# EAGLE design plinkykeeb_choc_12Feb2022 (EAGLE 9.6.2)
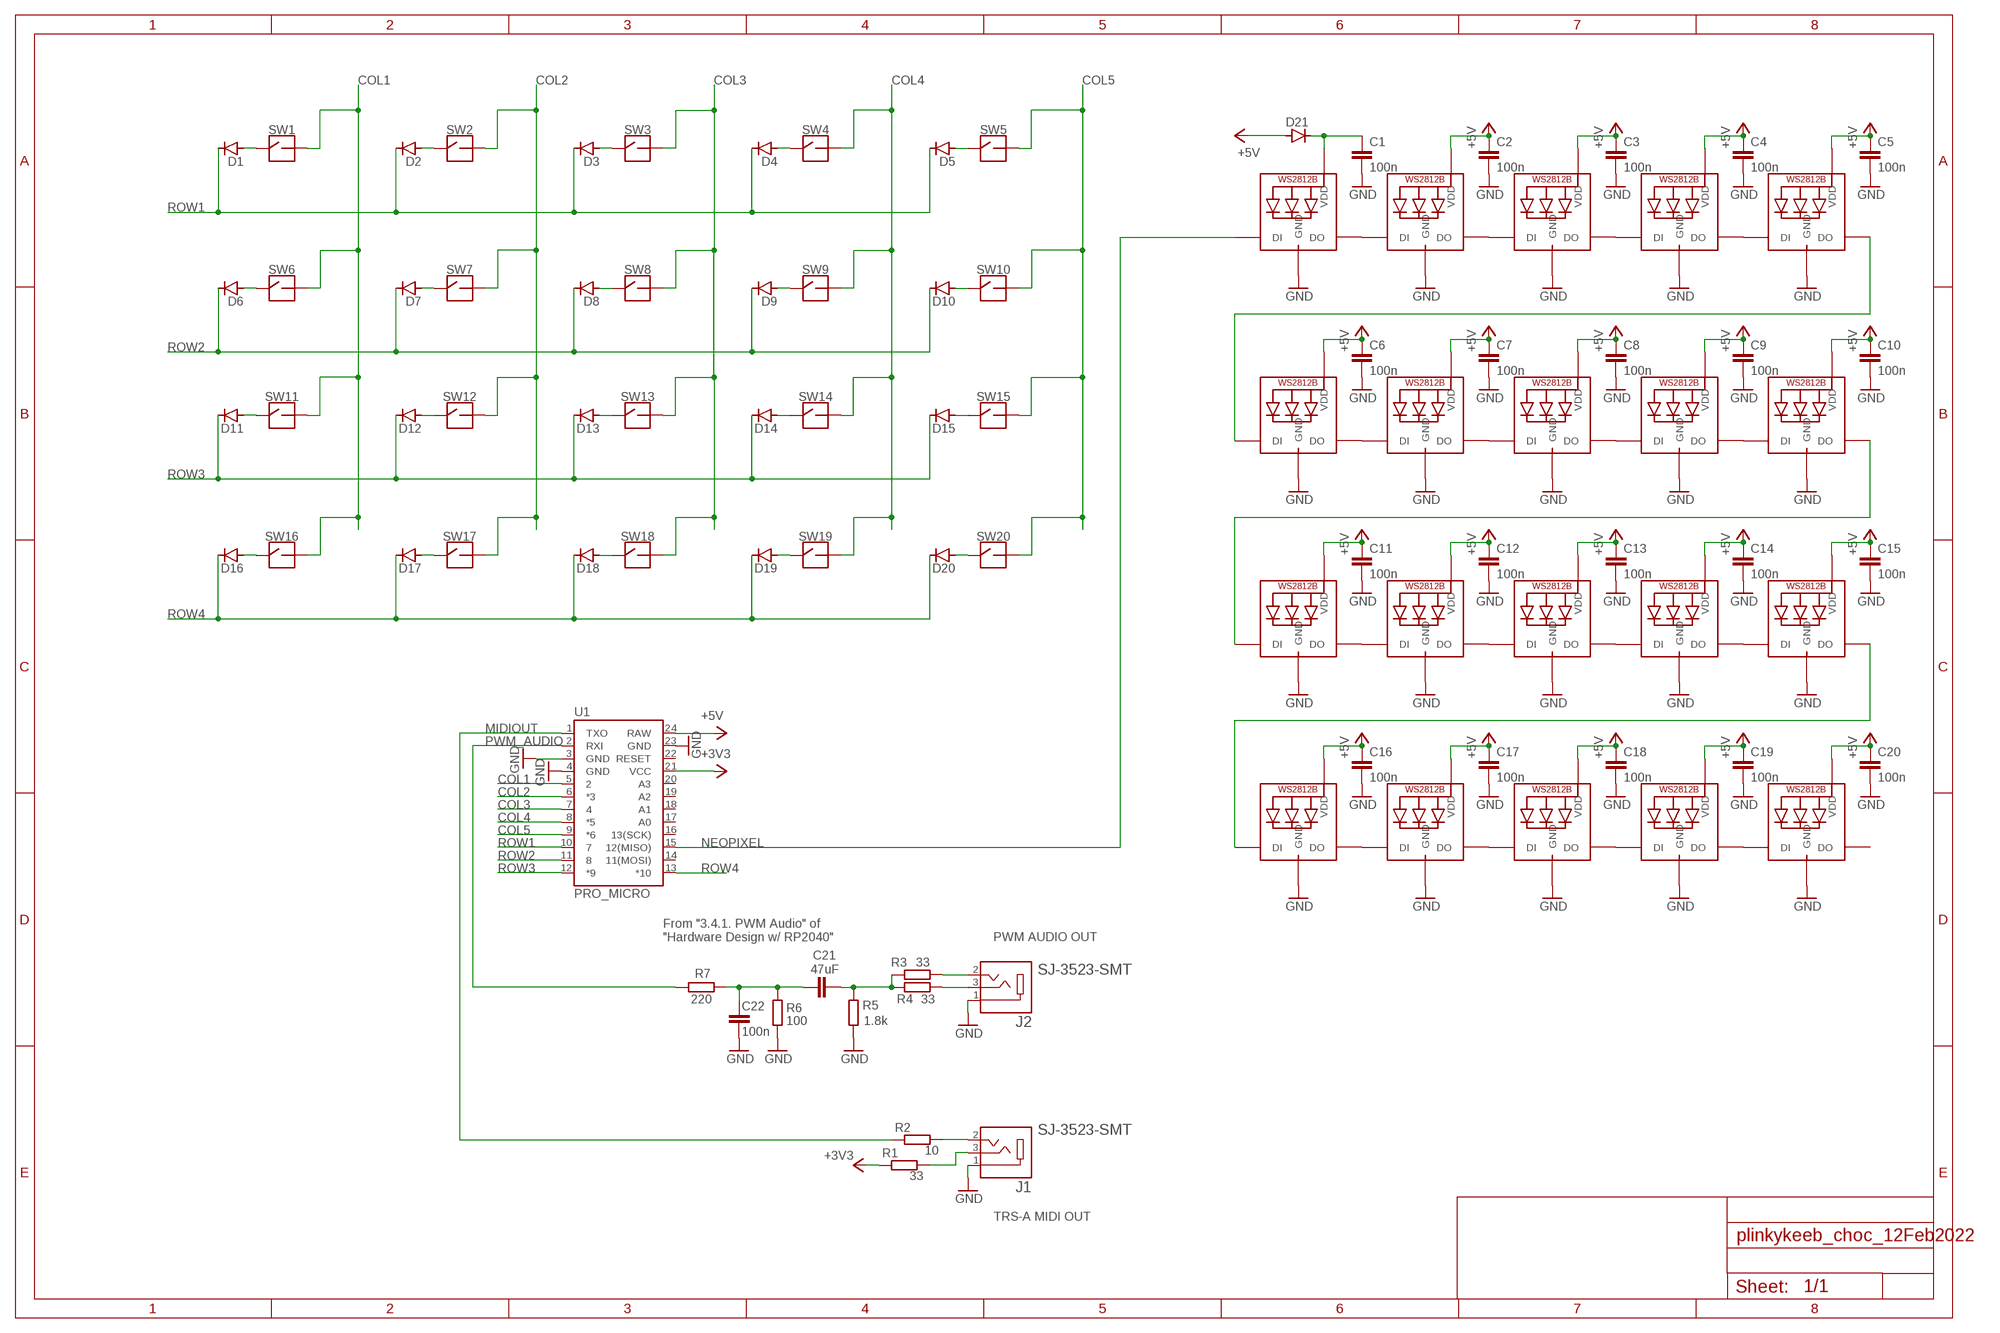
[diagram p0: schematic, sheet 1]

## Parts
C1  100n  C-EUC0805  [C0805]
C2  100n  C-EUC0805  [C0805]
C3  100n  C-EUC0805  [C0805]
C4  100n  C-EUC0805  [C0805]
C5  100n  C-EUC0805  [C0805]
C6  100n  C-EUC0805  [C0805]
C7  100n  C-EUC0805  [C0805]
C8  100n  C-EUC0805  [C0805]
C9  100n  C-EUC0805  [C0805]
C10  100n  C-EUC0805  [C0805]
C11  100n  C-EUC0805  [C0805]
C12  100n  C-EUC0805  [C0805]
C13  100n  C-EUC0805  [C0805]
C14  100n  C-EUC0805  [C0805]
C15  100n  C-EUC0805  [C0805]
C16  100n  C-EUC0805  [C0805]
C17  100n  C-EUC0805  [C0805]
C18  100n  C-EUC0805  [C0805]
C19  100n  C-EUC0805  [C0805]
C20  100n  C-EUC0805  [C0805]
C21  47uF  C-EUC0805  [C0805]
C22  100n  C-EUC0805  [C0805]
D1  D-SOD123  [SOD123]
D2  D-SOD123  [SOD123]
D3  D-SOD123  [SOD123]
D4  D-SOD123  [SOD123]
D5  D-SOD123  [SOD123]
D6  D-SOD123  [SOD123]
D7  D-SOD123  [SOD123]
D8  D-SOD123  [SOD123]
D9  D-SOD123  [SOD123]
D10  D-SOD123  [SOD123]
D11  D-SOD123  [SOD123]
D12  D-SOD123  [SOD123]
D13  D-SOD123  [SOD123]
D14  D-SOD123  [SOD123]
D15  D-SOD123  [SOD123]
D16  D-SOD123  [SOD123]
D17  D-SOD123  [SOD123]
D18  D-SOD123  [SOD123]
D19  D-SOD123  [SOD123]
D20  D-SOD123  [SOD123]
D21  D-SOD123  [SOD123]
J1  SJ-3523-SMT  [CUI_SJ-3523-SMT]
J2  SJ-3523-SMT  [CUI_SJ-3523-SMT]
LED1  MICROBUILDER_WS2812B_SK6812E  [MICROBUILDER_NEO3535_REVERSE]
LED2  MICROBUILDER_WS2812B_SK6812E  [MICROBUILDER_NEO3535_REVERSE]
LED3  MICROBUILDER_WS2812B_SK6812E  [MICROBUILDER_NEO3535_REVERSE]
LED4  MICROBUILDER_WS2812B_SK6812E  [MICROBUILDER_NEO3535_REVERSE]
LED5  MICROBUILDER_WS2812B_SK6812E  [MICROBUILDER_NEO3535_REVERSE]
LED6  MICROBUILDER_WS2812B_SK6812E  [MICROBUILDER_NEO3535_REVERSE]
LED7  MICROBUILDER_WS2812B_SK6812E  [MICROBUILDER_NEO3535_REVERSE]
LED8  MICROBUILDER_WS2812B_SK6812E  [MICROBUILDER_NEO3535_REVERSE]
LED9  MICROBUILDER_WS2812B_SK6812E  [MICROBUILDER_NEO3535_REVERSE]
LED10  MICROBUILDER_WS2812B_SK6812E  [MICROBUILDER_NEO3535_REVERSE]
LED11  MICROBUILDER_WS2812B_SK6812E  [MICROBUILDER_NEO3535_REVERSE]
LED12  MICROBUILDER_WS2812B_SK6812E  [MICROBUILDER_NEO3535_REVERSE]
LED13  MICROBUILDER_WS2812B_SK6812E  [MICROBUILDER_NEO3535_REVERSE]
LED14  MICROBUILDER_WS2812B_SK6812E  [MICROBUILDER_NEO3535_REVERSE]
LED15  MICROBUILDER_WS2812B_SK6812E  [MICROBUILDER_NEO3535_REVERSE]
LED16  MICROBUILDER_WS2812B_SK6812E  [MICROBUILDER_NEO3535_REVERSE]
LED17  MICROBUILDER_WS2812B_SK6812E  [MICROBUILDER_NEO3535_REVERSE]
LED18  MICROBUILDER_WS2812B_SK6812E  [MICROBUILDER_NEO3535_REVERSE]
LED19  MICROBUILDER_WS2812B_SK6812E  [MICROBUILDER_NEO3535_REVERSE]
LED20  MICROBUILDER_WS2812B_SK6812E  [MICROBUILDER_NEO3535_REVERSE]
R1  33  R-EU_R0805  [R0805]
R2  10  R-EU_R0805  [R0805]
R3  33  R-EU_R0805  [R0805]
R4  33  R-EU_R0805  [R0805]
R5  1.8k  R-EU_R0805  [R0805]
R6  100  R-EU_R0805  [R0805]
R7  220  R-EU_R0805  [R0805]
SW1  KBD_SWITCHKALIH_CHOC_SOCKET  [KALIH_SOCKET_CHOC]
SW2  KBD_SWITCHKALIH_CHOC_SOCKET  [KALIH_SOCKET_CHOC]
SW3  KBD_SWITCHKALIH_CHOC_SOCKET  [KALIH_SOCKET_CHOC]
SW4  KBD_SWITCHKALIH_CHOC_SOCKET  [KALIH_SOCKET_CHOC]
SW5  KBD_SWITCHKALIH_CHOC_SOCKET  [KALIH_SOCKET_CHOC]
SW6  KBD_SWITCHKALIH_CHOC_SOCKET  [KALIH_SOCKET_CHOC]
SW7  KBD_SWITCHKALIH_CHOC_SOCKET  [KALIH_SOCKET_CHOC]
SW8  KBD_SWITCHKALIH_CHOC_SOCKET  [KALIH_SOCKET_CHOC]
SW9  KBD_SWITCHKALIH_CHOC_SOCKET  [KALIH_SOCKET_CHOC]
SW10  KBD_SWITCHKALIH_CHOC_SOCKET  [KALIH_SOCKET_CHOC]
SW11  KBD_SWITCHKALIH_CHOC_SOCKET  [KALIH_SOCKET_CHOC]
SW12  KBD_SWITCHKALIH_CHOC_SOCKET  [KALIH_SOCKET_CHOC]
SW13  KBD_SWITCHKALIH_CHOC_SOCKET  [KALIH_SOCKET_CHOC]
SW14  KBD_SWITCHKALIH_CHOC_SOCKET  [KALIH_SOCKET_CHOC]
SW15  KBD_SWITCHKALIH_CHOC_SOCKET  [KALIH_SOCKET_CHOC]
SW16  KBD_SWITCHKALIH_CHOC_SOCKET  [KALIH_SOCKET_CHOC]
SW17  KBD_SWITCHKALIH_CHOC_SOCKET  [KALIH_SOCKET_CHOC]
SW18  KBD_SWITCHKALIH_CHOC_SOCKET  [KALIH_SOCKET_CHOC]
SW19  KBD_SWITCHKALIH_CHOC_SOCKET  [KALIH_SOCKET_CHOC]
SW20  KBD_SWITCHKALIH_CHOC_SOCKET  [KALIH_SOCKET_CHOC]
U1  PRO_MICRO  SPARKFUN_PRO_MICRO  [SPARKFUN_PRO_MICRO]

## Nets
+3V3: R1.2 U1.21(VCC)
+5V: C2.1 C3.1 C4.1 C5.1 C6.1 C7.1 C8.1 C9.1 C10.1 C11.1 C12.1 C13.1 C14.1 C15.1 C16.1 C17.1 C18.1 C19.1 C20.1 D21.2(A) LED2.1-VDD(VDD) LED3.1-VDD(VDD) LED4.1-VDD(VDD) LED5.1-VDD(VDD) LED6.1-VDD(VDD) LED7.1-VDD(VDD) LED8.1-VDD(VDD) LED9.1-VDD(VDD) LED10.1-VDD(VDD) LED11.1-VDD(VDD) LED12.1-VDD(VDD) LED13.1-VDD(VDD) LED14.1-VDD(VDD) LED15.1-VDD(VDD) LED16.1-VDD(VDD) LED17.1-VDD(VDD) LED18.1-VDD(VDD) LED19.1-VDD(VDD) LED20.1-VDD(VDD) U1.24(RAW)
COL1: SW1.2 SW6.2 SW11.2 SW16.2 U1.5
COL2: SW2.2 SW7.2 SW12.2 SW17.2 U1.6(*3)
COL3: SW3.2 SW8.2 SW13.2 SW18.2 U1.7
COL4: SW4.2 SW9.2 SW14.2 SW19.2 U1.8(*5)
COL5: SW5.2 SW10.2 SW15.2 SW20.2 U1.9(*6)
GND: C1.2 C2.2 C3.2 C4.2 C5.2 C6.2 C7.2 C8.2 C9.2 C10.2 C11.2 C12.2 C13.2 C14.2 C15.2 C16.2 C17.2 C18.2 C19.2 C20.2 C22.2 J1.1 J2.1 LED1.3-GND(GND) LED2.3-GND(GND) LED3.3-GND(GND) LED4.3-GND(GND) LED5.3-GND(GND) LED6.3-GND(GND) LED7.3-GND(GND) LED8.3-GND(GND) LED9.3-GND(GND) LED10.3-GND(GND) LED11.3-GND(GND) LED12.3-GND(GND) LED13.3-GND(GND) LED14.3-GND(GND) LED15.3-GND(GND) LED16.3-GND(GND) LED17.3-GND(GND) LED18.3-GND(GND) LED19.3-GND(GND) LED20.3-GND(GND) R5.2 R6.1 U1.3(GND) U1.4(GND) U1.23(GND)
MIDIOUT: R2.2 U1.1(TXO)
N$1: LED1.2-DOUT(DO) LED2.4-DIN(DI)
N$2: LED2.2-DOUT(DO) LED3.4-DIN(DI)
N$3: LED3.2-DOUT(DO) LED4.4-DIN(DI)
N$4: LED4.2-DOUT(DO) LED5.4-DIN(DI)
N$5: LED5.2-DOUT(DO) LED6.4-DIN(DI)
N$6: D1.2(A) SW1.1
N$7: D2.2(A) SW2.1
N$8: D3.2(A) SW3.1
N$9: D4.2(A) SW4.1
N$10: D5.2(A) SW5.1
N$11: C1.1 D21.1(C) LED1.1-VDD(VDD)
N$12: D6.2(A) SW6.1
N$13: D18.2(A) SW18.1
N$14: D8.2(A) SW8.1
N$15: D9.2(A) SW9.1
N$16: D10.2(A) SW10.1
N$17: D11.2(A) SW11.1
N$18: D12.2(A) SW12.1
N$19: D13.2(A) SW13.1
N$20: D14.2(A) SW14.1
N$21: D15.2(A) SW15.1
N$22: D16.2(A) SW16.1
N$23: D17.2(A) SW17.1
N$24: D19.2(A) SW19.1
N$25: D20.2(A) SW20.1
N$27: LED7.2-DOUT(DO) LED8.4-DIN(DI)
N$28: LED8.2-DOUT(DO) LED9.4-DIN(DI)
N$29: LED9.2-DOUT(DO) LED10.4-DIN(DI)
N$30: LED10.2-DOUT(DO) LED11.4-DIN(DI)
N$31: LED11.2-DOUT(DO) LED12.4-DIN(DI)
N$32: LED6.2-DOUT(DO) LED7.4-DIN(DI)
N$33: D7.2(A) SW7.1
N$34: LED13.2-DOUT(DO) LED14.4-DIN(DI)
N$35: LED14.2-DOUT(DO) LED15.4-DIN(DI)
N$36: LED15.2-DOUT(DO) LED16.4-DIN(DI)
N$37: LED16.2-DOUT(DO) LED17.4-DIN(DI)
N$38: LED17.2-DOUT(DO) LED18.4-DIN(DI)
N$39: LED12.2-DOUT(DO) LED13.4-DIN(DI)
N$40: LED19.2-DOUT(DO) LED20.4-DIN(DI)
N$41: LED18.2-DOUT(DO) LED19.4-DIN(DI)
N$42: J1.2 R2.1
N$43: J1.3 R1.1
N$44: J2.2 R3.1
N$46: J2.3 R4.1
N$47: C21.2 R3.2 R4.2 R5.1
N$48: C21.1 C22.1 R6.2 R7.1
NEOPIXEL: LED1.4-DIN(DI) U1.15(12(MISO))
PWM_AUDIO: R7.2 U1.2(RXI)
ROW1: D1.1(C) D2.1(C) D3.1(C) D4.1(C) D5.1(C) U1.10
ROW2: D6.1(C) D7.1(C) D8.1(C) D9.1(C) D10.1(C) U1.11
ROW3: D11.1(C) D12.1(C) D13.1(C) D14.1(C) D15.1(C) U1.12(*9)
ROW4: D16.1(C) D17.1(C) D18.1(C) D19.1(C) D20.1(C) U1.13(*10)
Unconnected: LED20.2-DOUT(DO) U1.14(11(MOSI)) U1.16(13(SCK)) U1.17(A0) U1.18(A1) U1.19(A2) U1.20(A3) U1.22(RESET)

## Notes on the sheet
- From "3.4.1. PWM Audio" of
  "Hardware Design w/ RP2040"
- PWM AUDIO OUT
- TRS-A MIDI OUT

## Library data of the parts
C1-C22 = rcl:C-EU: CAPACITOR, European symbol; SPICEPREFIX: C
D1-D21 = semicon-smd-ipc:D-: DIODE unfilled
J1 J2 = SJ-3523-SMT:SJ-3523-SMT: Audio Jack Connector 3.5 mm Low Profile Surface Mount Stereo Jack, 3 Pin Right-Angle; CUI_PURCHASE_URL: https://www.cuidevices.com/product/interconnect/connectors/audio-connectors/jacks/sj-352x-smt-series?utm_source=snapeda.com&utm_medium=referral&utm_campaign=snapedaBOM; DESCRIPTION: 3.5 mm, Stereo, Right Angle, Surface Mount (SMT), 3 Conductors, 0~1 Internal Switches, Audio Jack Connector; DIGI-KEY_PART_NUMBER: CP-3523SJCT-ND; MF: CUI Devices; MP: SJ-3523-SMT-TR; PACKAGE: None; PURCHASE-URL: https://pricing.snapeda.com/search/part/SJ-3523-SMT-TR/?ref=eda
LED1-LED20 = Adafruit MacroPad 2040:MICROBUILDER_WS2812B
R1-R7 = rcl:R-EU_: RESISTOR, European symbol; SPICEPREFIX: R
SW1-SW20 = Adafruit MacroPad 2040:KBD_SWITCH
U1 = SparkFun-Boards:SPARKFUN_PRO_MICRO: SparkFun Pro Micro Atmega32U4 compatible footprint. SparkFun Products: 3.3V/8MHz <https://www.sparkfun.com/products/12587> 5V/16MHz <https://www.sparkfun.com/products/12640>

## Board
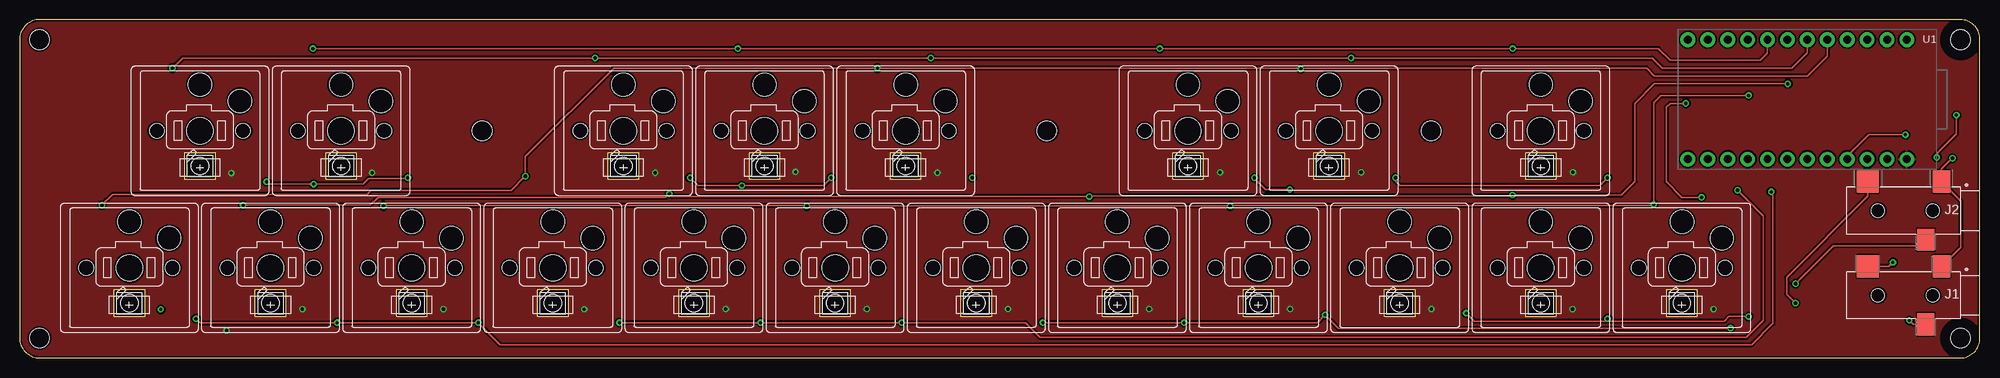
[diagram p1: board, top side]
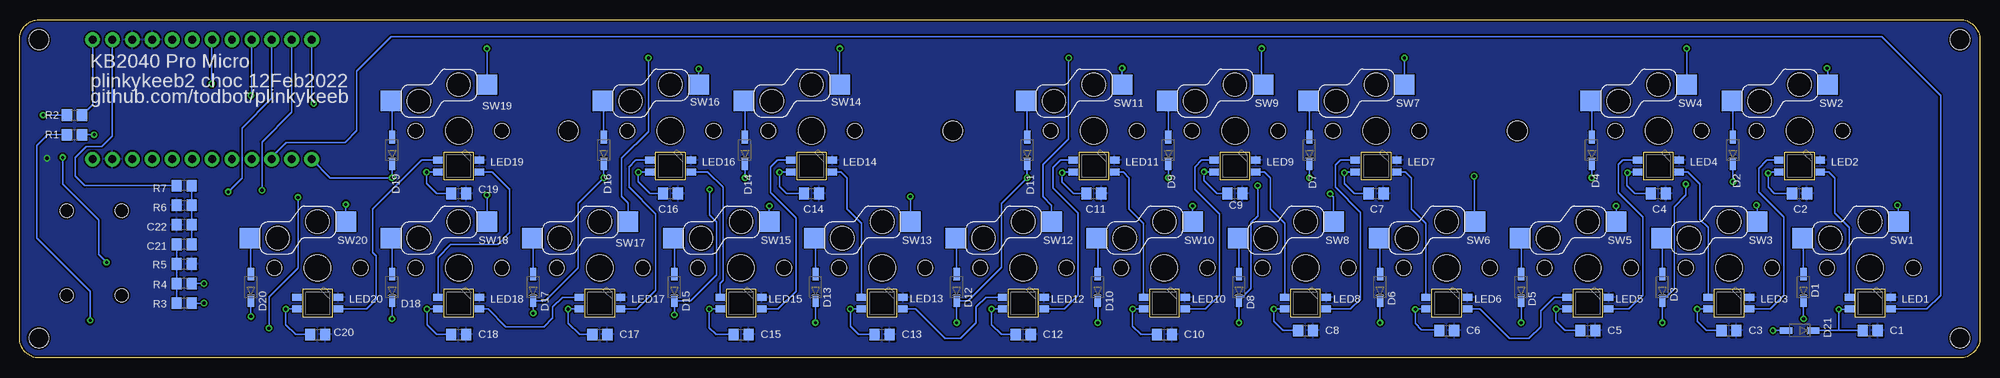
[diagram p2: board, bottom side, seen from below]

Size 250 x 43.2 mm. Coordinates in mm from the lower left corner, seen from the top.
Outline: 0,40.64 0,2.54 arc90 2.54,0 247.52,0 arc90 250,2.54 250,40.64 arc90 247.54,43.2 2.54,43.2 arc90 0,40.64
Copper layers (1*16): Top 0.035mm / dielectric 1.5mm / Bottom 0.035mm
Design rules "adafruit-rules-20180530": minimum track width 8mil, minimum drill 16mil, track to track 8mil, track to pad 8mil, pad to pad 8mil, via to via 8mil, smd to smd 8mil, copper to edge 10mil, drill to drill 8mil, minimum pad ring 10mil, minimum via ring 8mil, stop-mask expansion 4mil, vias tented up to drill 20mil, thermal gap 10mil
Holes 2.54 mm at 2.54,40.64 2.54,2.54 247.54,2.54 247.54,40.64 59,29 131,29 180,29
tRestrict: area 245,38.1 to 250.1,43.2; area 245,0 to 250.1,5.1

### Footprints (pad centres in the part's own frame; a part is rotated, then mirrored left to right if it is on the bottom)
C0805 = smd 1.3 x 1.5: 1 -0.95,0; 2 0.95,0
SOD123 = smd 1.6 x 0.8: 1 -1.7,0; 2 1.7,0
CUI_SJ-3523-SMT = smd 2.2 x 2.8: 1 -1.1,-3.7; 3 0.9,3.7 | smd 2.8 x 2.8: 2 8.3,-3.7 | hole 1.7: 0,0; 7,0
MICROBUILDER_NEO3535_REVERSE = smd 1.2 x 0.9 bottom: 1-VDD 2.65,-0.75; 2-DOUT 2.65,0.75; 3-GND -2.65,0.75; 4-DIN -2.65,-0.75
R0805 = smd 1.3 x 1.5: 1 -0.95,0; 2 0.95,0
KALIH_SOCKET_CHOC = smd 2.6 x 2.6 bottom: 1 8.63,3.8; 2 -3.607,5.9 | hole 3.4: 0,0 | hole 3: 5.08,3.8; 0,5.9 | hole 1.9: 5.5,0; -5.5,0
SPARKFUN_PRO_MICRO = drill 1.016 pad 1.88: 1 -7.62,12.7; 2 -7.62,10.16; 3 -7.62,7.62; 4 -7.62,5.08; 5 -7.62,2.54; 6 -7.62,0; 7 -7.62,-2.54; 8 -7.62,-5.08; 9 -7.62,-7.62; 10 -7.62,-10.16; 11 -7.62,-12.7; 12 -7.62,-15.24; 13 7.62,-15.24; 14 7.62,-12.7; 15 7.62,-10.16; 16 7.62,-7.62; 17 7.62,-5.08; 18 7.62,-2.54; 19 7.62,0; 20 7.62,2.54; 21 7.62,5.08; 22 7.62,7.62; 23 7.62,10.16; 24 7.62,12.7

### Placement (x,y rotation side)
C1  14,3.5 0 bottom
C2  23,21 0 bottom
C3  32,3.5 0 bottom
C4  41,21 0 bottom
C5  50,3.5 0 bottom
C6  68,3.5 0 bottom
C7  77,21 0 bottom
C8  86,3.5 0 bottom
C9  95,21 0 bottom
C10  104,3 0 bottom
C11  113,21 0 bottom
C12  122,3 0 bottom
C13  140,3 0 bottom
C14  149,21 0 bottom
C15  158,3 0 bottom
C16  167,21 0 bottom
C17  176,3 0 bottom
C18  194,3 0 bottom
C19  194,21 0 bottom
C20  212,3 0 bottom
C21  229,14.5 180 bottom
C22  229,17 180 bottom
D1  22.5,9 90 bottom
D2  31.5,26.5 90 bottom
D3  40.5,9 90 bottom
D4  49.5,26.5 90 bottom
D5  58.5,9 90 bottom
D6  76.5,9 90 bottom
D7  85.5,26.5 90 bottom
D8  94.5,9 90 bottom
D9  103.5,26.5 90 bottom
D10  112.5,9 90 bottom
D11  121.5,26.5 90 bottom
D12  130.5,9 90 bottom
D13  148.5,9 90 bottom
D14  157.5,26.5 90 bottom
D15  166.5,9 90 bottom
D16  175.5,26.5 90 bottom
D17  184.5,9 90 bottom
D18  202.5,9 90 bottom
D19  202.5,26.5 90 bottom
D20  220.5,9 90 bottom
D21  23,3.5 180 bottom
J1  244,8 180 top
J2  244,18.8 180 top
LED1  14,7 0 top
LED2  23,24.5 0 top
LED3  32,7 0 top
LED4  41,24.5 0 top
LED5  50,7 0 top
LED6  68,7 0 top
LED7  77,24.5 0 top
LED8  86,7 0 top
LED9  95,24.5 0 top
LED10  104,7 0 top
LED11  113,24.5 0 top
LED12  122,7 0 top
LED13  140,7 0 top
LED14  149,24.5 0 top
LED15  158,7 0 top
LED16  167,24.5 0 top
LED17  176,7 0 top
LED18  194,7 0 top
LED19  194,24.5 0 top
LED20  212,7 0 top
R1  243,28.5 0 bottom
R2  243,31 0 bottom
R3  229,7 180 bottom
R4  229,9.5 180 bottom
R5  229,12 0 bottom
R6  229,19.5 0 bottom
R7  229,22 180 bottom
SW1  14,11.5 0 top
SW2  23,29 0 top
SW3  32,11.5 0 top
SW4  41,29 0 top
SW5  50,11.5 0 top
SW6  68,11.5 0 top
SW7  77,29 0 top
SW8  86,11.5 0 top
SW9  95,29 0 top
SW10  104,11.5 0 top
SW11  113,29 0 top
SW12  122,11.5 0 top
SW13  140,11.5 0 top
SW14  149,29 0 top
SW15  158,11.5 0 top
SW16  167,29 0 top
SW17  176,11.5 0 top
SW18  194,11.5 0 top
SW19  194,29 0 top
SW20  212,11.5 0 top
U1  228,33 270 top

### Tracks (layer width: path | path; a pad name or v marks a point on that pad's centre or on a via)
+3V3  (via drill 0.41)
  Top 0.203: U1.21 233.08,25.78 235.8,28.5 v240.5,28.5
  Bottom 0.203: v240.5,28.5 R1.2
+5V  (via drill 0.41)
  Bottom 0.203: LED8.1-VDD v90.05,6.25 90.05,4.65 88.9,3.5 C8.1 | LED10.1-VDD v108.05,6.25 108.05,4.05 107,3 C10.1 | LED13.1-VDD v144.05,6.25 144.05,4.05 143,3 C13.1 | LED15.1-VDD v162.05,6.25 162.05,3.85 161.2,3 C15.1 | LED17.1-VDD v180.05,6.25 180.05,4.45 178.6,3 C17.1 | LED18.1-VDD v198.05,6.25 198.05,4.25 196.8,3 C18.1 | LED4.1-VDD 44.9,23.75 44.95,23.7 v44.95,23.65 45,23.65 45,22 44,21 C4.1 | LED12.1-VDD v126.05,6.25 126.05,4.25 124.8,3 C12.1 | LED3.1-VDD v36.05,6.25 36.05,4.65 34.9,3.5 C3.1 | LED2.1-VDD 26.85,23.75 v27,23.6 27,21.8 26.2,21 C2.1 | LED7.1-VDD 80.95,23.75 v81.05,23.65 81.05,22.25 79.8,21 C7.1 | C14.1 152.2,21 153.1,21.9 v153.1,23.7 153.05,23.75 LED14.1-VDD | LED11.1-VDD 116.95,23.75 v117.05,23.65 117.05,22.45 115.6,21 C11.1 | LED16.1-VDD 171.05,23.75 v171.1,23.7 171.1,22.5 169.6,21 C16.1 | LED19.1-VDD 198.05,23.75 v198.1,23.7 198.1,22.3 196.8,21 C19.1 | LED20.1-VDD v216.05,6.25 216.05,4.25 214.8,3 C20.1 | LED6.1-VDD 71.95,6.25 v72,6.2 72,4.4 71.2,3.6 69.05,3.6 C6.1 | C5.1 52.9,3.5 54.05,4.65 54.05,6.2 | 54.05,6.2 v54.05,6.25 | LED5.1-VDD 54,6.25 54.05,6.2 | D21.2 v26.4,3.5 | C9.1 97.3,21 98.95,22.65 v98.95,23.75 LED9.1-VDD
  pour Top: -0.77,43.72 250.85,43.72 250.85,-0.5 -0.77,-0.5
COL1  (via drill 0.41)
  Top 0.203: U1.5 230.54,38.54 228,36 208.5,36 207.5,37 163.5,37 v163.4,36.9 163.3,37 v109.4,37 75.8,37 64.5,25.7 v64.5,23.2 62.7,21.4 44.8,21.4 44.3,20.9 11.9,20.9 v10.5,19.5
  Bottom 0.203: SW1.2 10.39,19.39 v10.5,19.5 | v64.5,23.2 64.5,17.51 SW6.2 | SW11.2 v109.39,37 v109.4,37 | v163.4,36.9 SW16.2
COL2  (via drill 0.41)
  Top 0.203: v19.5,37 20.8,38.3 v73.4,38.3 v116.2,38.3 v169.8,38.3 208.2,38.3 209.5,37 226,37 228,39 U1.6
  Bottom 0.203: SW2.2 19.39,36.89 v19.5,37 | v73.4,38.3 SW7.2 | v116.2,38.3 116.22,38.28 116.22,27.98 119.5,24.7 119.5,20.6 118.39,19.49 SW12.2 | v169.8,38.3 169.8,28.9 173.2,25.5 173.2,20.6 172.39,19.79 SW17.2
COL3  (via drill 0.41)
  Top 0.203: v28.5,19.5 44.7,19.5 45.7,20.5 82.4,20.5 v82.85,20.95 83.2,20.6 v136.4,20.6 136.5,20.7 190,20.7 190.1,20.8 v190.4,20.8 204.3,20.8 206,22.5 206,32.5 208.5,35 v225.5,35
  Bottom 0.203: SW3.2 28.39,19.39 v28.5,19.5 | SW8.2 82.45,17.46 82.45,20.55 v82.85,20.95 | v136.4,20.6 v136.39,20.59 SW13.2 | v190.4,20.8 SW18.2 | v225.5,35 225.5,40.58 U1.7
COL4  (via drill 0.41)
  Top 0.203: v37.4,39.5 v91.6,39.5 v145.4,39.5 v190.4,39.5 209,39.5 210.5,38 222,38 222.92,38.92 U1.8
  Bottom 0.203: SW4.2 v37.39,39.49 v37.4,39.5 | v91.6,39.5 91.6,35.11 SW9.2 | v145.4,39.5 SW14.2 | v190.4,39.5 SW19.2
COL5  (via drill 0.41)
  Top 0.203: v46.4,19.4 46.46,19.46 100.34,19.46 v100.4,19.4 v154.4,19.4 154.4,19.41 154.44,19.46 208.26,19.46 v208.4,19.6 208.4,32.6 209.3,33.5 v220.5,33.5
  Bottom 0.203: SW5.2 v46.39,19.39 v46.4,19.4 | SW10.2 v100.4,19.4 | v154.4,19.4 SW15.2 | v208.4,19.6 SW20.2 | v220.5,33.5 220.38,33.5 U1.9
GND  (via drill 0.41)
  Top 0.203: J1.1 247.54,14.14 247.54,20.06 J2.1 245.1,24.1 v246.5,25.5
  pour Bottom: -1.27,46.99 251.35,46.99 251.35,0 -1.27,0
MIDIOUT
  Bottom 0.203: R2.2 240.7,32.35 U1.1
N$1
  Bottom 0.203: LED1.2-DOUT 16.65,16.65 18.5,18.5 18.5,23 19.25,23.75 LED2.4-DIN
N$2
  Bottom 0.203: LED2.2-DOUT 27.15,25.25 28.2,24.2 28.2,21.2 25,18 25,8 26.75,6.25 LED3.4-DIN
N$3
  Bottom 0.203: LED3.2-DOUT 34.65,16.65 35.7,17.7 35.7,22.2 37.25,23.75 LED4.4-DIN
N$4
  Bottom 0.203: LED4.2-DOUT 45.55,25.25 46.1,24.7 46.1,21.1 43,18 43,8 44.75,6.25 LED5.4-DIN
N$5
  Bottom 0.203: LED6.4-DIN 63.75,6.25 60,2.5 57.5,2.5 56,4 56,6 54.25,7.75 LED5.2-DOUT
N$6
  Bottom 0.203: D1.2 22.5,15.17 SW1.1
N$7
  Bottom 0.203: D2.2 31.5,32.67 SW2.1
N$8
  Bottom 0.203: D3.2 40.5,15.17 SW3.1
N$9
  Bottom 0.203: D4.2 49.5,32.67 SW4.1
N$10
  Bottom 0.203: D5.2 58.5,15.17 SW5.1
N$11  (via drill 0.41)
  Bottom 0.203: LED1.1-VDD 16.7,6.2 v18,6.2 18,3.5 | D21.1 18,3.5 | 18,3.5 C1.1
N$12
  Bottom 0.203: D6.2 76.5,15.17 SW6.1
N$13
  Bottom 0.203: D18.2 202.5,15.17 SW18.1
N$14
  Bottom 0.203: D8.2 94.5,15.17 SW8.1
N$15
  Bottom 0.203: D9.2 103.5,32.67 SW9.1
N$16
  Bottom 0.203: D10.2 112.5,15.17 SW10.1
N$17
  Bottom 0.203: D11.2 121.5,32.67 SW11.1
N$18
  Bottom 0.203: D12.2 130.5,15.17 SW12.1
N$19
  Bottom 0.203: D13.2 148.5,15.17 SW13.1
N$20
  Bottom 0.203: D14.2 157.5,32.67 SW14.1
N$21
  Bottom 0.203: D15.2 166.5,15.17 SW15.1
N$22
  Bottom 0.203: D16.2 175.5,32.67 SW16.1
N$23
  Bottom 0.203: D17.2 184.5,15.17 SW17.1
N$24
  Bottom 0.203: D19.2 202.5,32.67 SW19.1
N$25
  Bottom 0.203: D20.2 220.5,15.17 SW20.1
N$27
  Bottom 0.203: LED8.4-DIN 80.25,6.25 79,7.5 79,18.6 82.2,21.8 82.2,24.6 81.55,25.25 LED7.2-DOUT
N$28
  Bottom 0.203: LED8.2-DOUT 88.65,17.15 90.5,19 90.5,23 91.25,23.75 LED9.4-DIN
N$29
  Bottom 0.203: LED9.2-DOUT 99.25,25.25 100.1,24.4 100.1,21.5 97,18.4 97,8 98.75,6.25 LED10.4-DIN
N$30
  Bottom 0.203: LED10.2-DOUT 106.65,17.15 108.5,19 108.5,23 109.25,23.75 LED11.4-DIN
N$31
  Bottom 0.203: LED11.2-DOUT 117.25,25.25 118.2,24.3 118.2,21.7 115,18.5 115,8 116.75,6.25 LED12.4-DIN
N$32
  Bottom 0.203: LED6.2-DOUT 70.65,17.15 72.5,19 72.5,23 73.25,23.75 LED7.4-DIN
N$33
  Bottom 0.203: D7.2 85.5,32.67 SW7.1
N$34
  Bottom 0.203: LED13.2-DOUT 142.65,17.15 144.5,19 144.5,23 145.25,23.75 LED14.4-DIN
N$35
  Bottom 0.203: LED14.2-DOUT 153.35,25.25 154.2,24.4 154.2,21.1 151,17.9 151,8.5 153.25,6.25 LED15.4-DIN
N$36
  Bottom 0.203: LED16.4-DIN 162.25,23.75 160.3,21.8 160.3,9.9 160.65,9.55 LED15.2-DOUT
N$37
  Bottom 0.203: LED16.2-DOUT 171.45,25.25 172.3,24.4 172.3,21.8 168.9,18.4 168.9,8.6 171.25,6.25 LED17.4-DIN
N$38
  Bottom 0.203: LED18.4-DIN 190.25,6.25 188,4 183.1,4 182,5.1 182,6.5 180.75,7.75 LED17.2-DOUT
N$39
  Bottom 0.203: LED13.4-DIN 135.75,6.25 132,2.5 130,2.5 128,4.5 128,6.5 126.75,7.75 LED12.2-DOUT
N$40
  Bottom 0.203: LED19.2-DOUT 198.75,25.25 205,19 205,13.5 204.5,13 204.5,7.5 205.75,6.25 LED20.4-DIN
N$41
  Bottom 0.203: LED18.2-DOUT 196.65,12.85 195,14.5 189,14.5 187.5,16 187.5,21.5 189.75,23.75 LED19.4-DIN
N$42  (via drill 0.41)
  Top 0.203: v238.9,12.2 238.4,11.7 J1.2 | v247,31 247,28.6 244.5,26.1 v244.5,25.6
  Bottom 0.203: v238.9,12.2 239.9,13.2 239.9,17.6 244.5,22.2 v244.5,25.6 | R2.1 v247,31
N$43  (via drill 0.41)
  Top 0.203: J1.3 241.5,4.3 v241,4.8
  Bottom 0.203: R1.1 246.4,28.5 247.8,27.1 247.8,15.3 241,8.5 v241,4.8
N$44  (via drill 0.41)
  Top 0.203: J2.2 235.7,20.66 225.35,10.31 225.35,8.15 v226.5,7
  Bottom 0.203: R3.1 v226.5,7
N$46  (via drill 0.41)
  Top 0.203: J2.3 242.3,14.3 231.3,14.3 v226.5,9.5
  Bottom 0.203: R4.1 v226.5,9.5
N$47
  Bottom 0.203: C21.2 R5.1 R4.2 R3.2
N$48
  Bottom 0.203: R7.1 R6.2 C22.1 C21.1
NEOPIXEL
  Bottom 0.203: LED1.4-DIN 6.75,6.25 5,8 5,33.5 12.5,41 202.6,41 207,36.6 207,29 208.5,27.5 216,27.5 217.84,25.66 U1.15
PWM_AUDIO
  Bottom 0.203: R7.2 241.7,22 242.9,23.2 242.9,25.6 241.5,27 239.5,27 238.16,28.34 U1.2
ROW1  (via drill 0.41)
  Top 0.203: v22.5,5 23,4.5 v40.5,4.5 v58.5,4.5 61.3,1.7 220.9,1.7 223.6,4.4 223.6,21 v223.4,21.2 | v31.5,22.5 31.8,22.2 v37.5,22.2 43.8,22.2 44.5,22.9 49.4,22.9 v49.5,23
  Bottom 0.203: D5.1 v58.5,4.5 | v40.5,4.5 D3.1 39,8.8 39,19.3 37.5,20.8 v37.5,22.2 | D1.1 v22.5,5 | D4.1 v49.5,23 | D2.1 v31.5,22.5 | v223.4,21.2 221.62,22.98 221.62,29.38 217.84,33.16 U1.10
ROW2  (via drill 0.41)
  Top 0.203: v76.5,4.5 v94.5,4.5 v112.5,4.5 128.3,4.5 130.16,2.64 220.24,2.64 222.4,4.8 222.4,18.1 v219.1,21.4 | v103.5,23 102.5,22 v92.1,22 86.5,22 v85.5,23
  Bottom 0.203: D10.1 v112.5,4.5 | v94.5,4.5 D8.1 92.94,8.86 92.94,17.27 92.1,18.1 v92.1,22 | v76.5,4.5 D6.1 | D9.1 v103.5,23 | D7.1 v85.5,23 | v219.1,21.4 219.09,21.41 219.09,27.59 215.3,31.37 U1.11
ROW3  (via drill 0.41)
  Top 0.203: v130.5,4.5 v148.5,4.5 165.5,4.5 v166.5,5.5 168.2,3.8 v218.2,3.8 | v162,21.5 158.9,21.5 157.5,22.9 v157.5,23 | v212.5,32.5 210.5,32.5 210,32 210,22.5 212,20.5 v214.5,20.5
  Bottom 0.203: v166.5,5.5 D15.1 164.45,7.3 161.12,10.63 161.12,17.37 162,18.24 v162,21.5 | v148.5,4.5 D13.1 | v130.5,4.5 D12.1 129.05,7.3 124.8,11.55 124.8,19.7 v121.5,23 D11.1 | D14.1 v157.5,23 | U1.12 212.76,32.76 v212.5,32.5 | v214.5,20.5 214.5,11.5 218.2,7.8 v218.2,3.8
ROW4  (via drill 0.41)
  Top 0.203: v220.5,5.3 218,5.3 217.4,4.7 202.8,4.7 v202.5,5 202.2,4.7 185.51,4.7 v184.5,5.71 | v202.5,23 201.5,22 176,22 175.5,22.5 v175.5,23
  Bottom 0.203: D20.1 v220.5,5.3 | v202.5,5 D18.1 | v184.5,5.71 D17.1 183,7.3 178.8,11.5 178.8,19.7 v175.5,23 D16.1 | D19.1 v202.5,23 210.38,23 U1.13

### Text on the board
bPlace: KB2040 Pro Micro | plinkykeeb2 choc 12Feb2022 | github.com/todbot/plinkykeeb
200bmp: /Users/tod/projects/synth/plinkykeeb/hardware/fooD.bmp